# EAGLE schematic industrial-microcontroller (EAGLE 7.7.0)
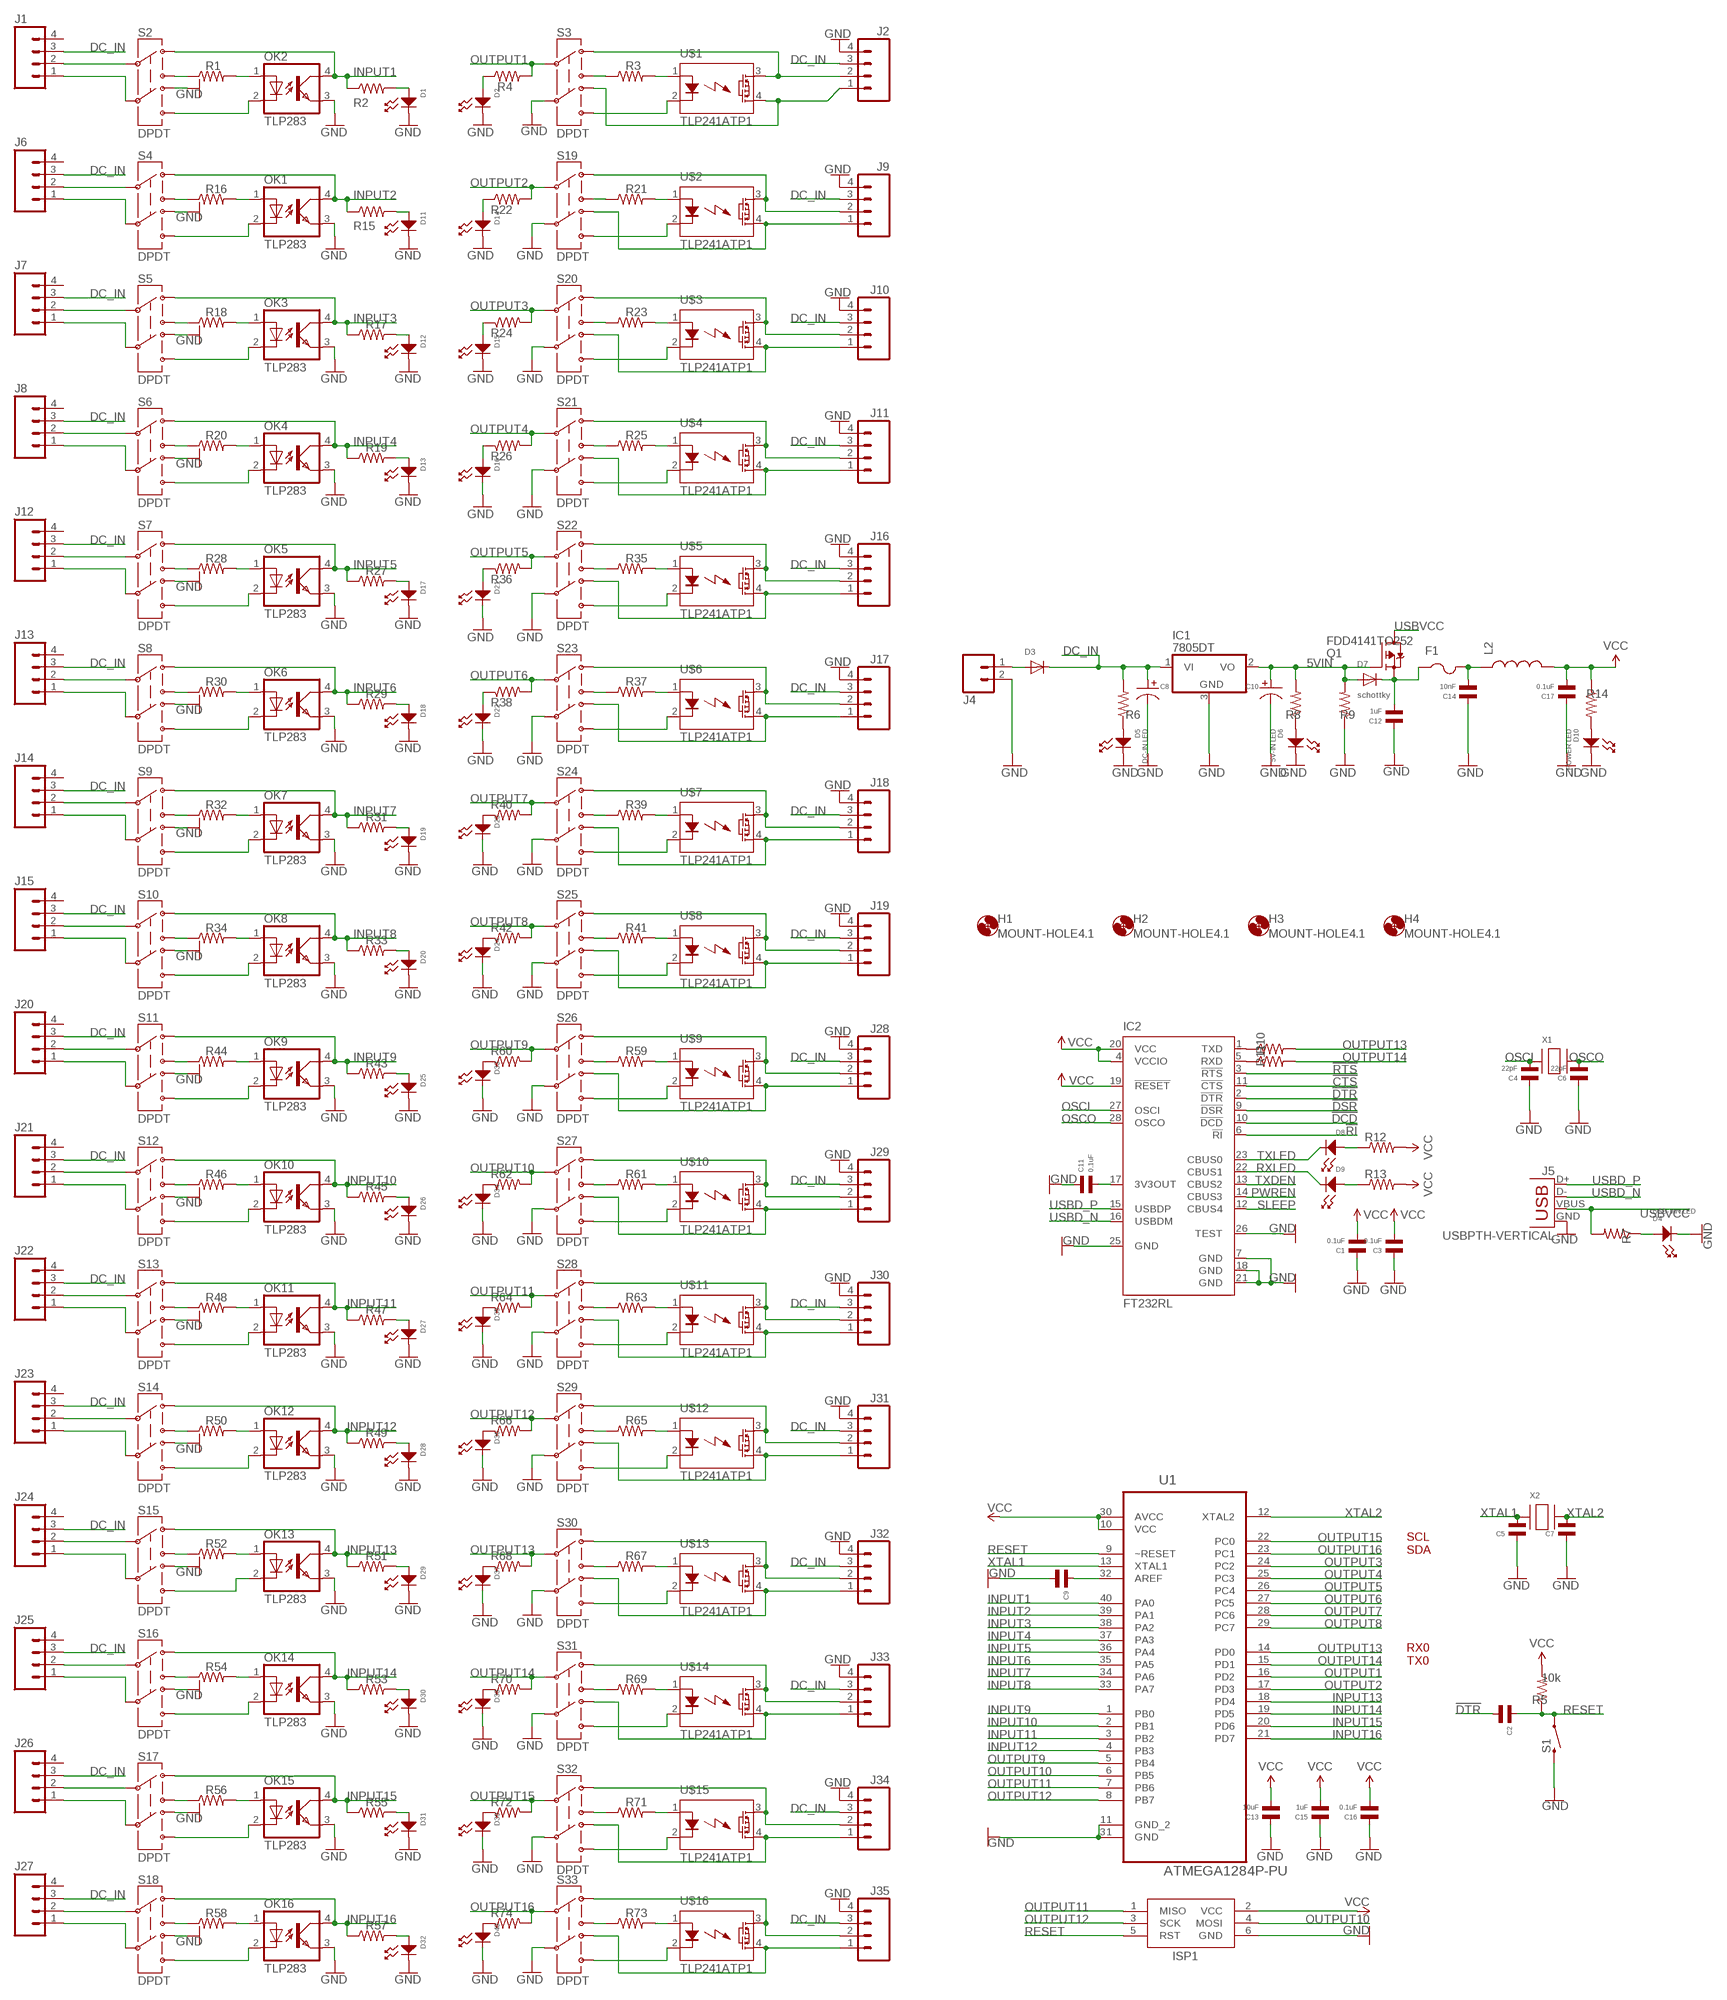
[diagram p0: schematic, sheet 1]

## Parts
C1  0.1uF  CAPACITOR_NP_0805  [C0805]
C2  CAPACITOR_NP_0805  [C0805]
C3  0.1uF  CAPACITOR_NP_0805  [C0805]
C4  22pF  CAPACITOR_NP_0805  [C0805]
C5  CAPACITOR_NP_0805  [C0805]
C6  22pF  CAPACITOR_NP_0805  [C0805]
C7  CAPACITOR_NP_0805  [C0805]
C8  CAPACITOR_P_10MM  [CP10MM]
C9  CAPACITOR_NP_0805  [C0805]
C10  CAPACITOR_P_10MM  [CP10MM]
C11  0.1uF  CAPACITOR_NP_0805  [C0805]
C12  1uF  CAPACITOR_NP_0805  [C0805]
C13  10uF  CAPACITOR_NP_0805  [C0805]
C14  10nF  CAPACITOR_NP_0805  [C0805]
C15  1uF  CAPACITOR_NP_0805  [C0805]
C16  0.1uF  CAPACITOR_NP_0805  [C0805]
C17  0.1uF  CAPACITOR_NP_0805  [C0805]
D1  LED_SINGLE-0805  [LED0805]
D2  LED_SINGLE-0805  [LED0805]
D3  DIODESMA  [SMADIODE]
D4  USB-VIN LED  LED_SINGLE-0805  [LED0805]
D5  DC-IN LED  LED_SINGLE-0805  [LED0805]
D6  5V-IN LED  LED_SINGLE-0805  [LED0805]
D7  schottky  DIODESMA  [SMADIODE]
D8  LED_SINGLE-0805  [LED0805]
D9  LED_SINGLE-0805  [LED0805]
D10  POWER LED  LED_SINGLE-0805  [LED0805]
D11  LED_SINGLE-0805  [LED0805]
D12  LED_SINGLE-0805  [LED0805]
D13  LED_SINGLE-0805  [LED0805]
D14  LED_SINGLE-0805  [LED0805]
D15  LED_SINGLE-0805  [LED0805]
D16  LED_SINGLE-0805  [LED0805]
D17  LED_SINGLE-0805  [LED0805]
D18  LED_SINGLE-0805  [LED0805]
D19  LED_SINGLE-0805  [LED0805]
D20  LED_SINGLE-0805  [LED0805]
D21  LED_SINGLE-0805  [LED0805]
D22  LED_SINGLE-0805  [LED0805]
D23  LED_SINGLE-0805  [LED0805]
D24  LED_SINGLE-0805  [LED0805]
D25  LED_SINGLE-0805  [LED0805]
D26  LED_SINGLE-0805  [LED0805]
D27  LED_SINGLE-0805  [LED0805]
D28  LED_SINGLE-0805  [LED0805]
D29  LED_SINGLE-0805  [LED0805]
D30  LED_SINGLE-0805  [LED0805]
D31  LED_SINGLE-0805  [LED0805]
D32  LED_SINGLE-0805  [LED0805]
D33  LED_SINGLE-0805  [LED0805]
D34  LED_SINGLE-0805  [LED0805]
D35  LED_SINGLE-0805  [LED0805]
D36  LED_SINGLE-0805  [LED0805]
D37  LED_SINGLE-0805  [LED0805]
D38  LED_SINGLE-0805  [LED0805]
D39  LED_SINGLE-0805  [LED0805]
D40  LED_SINGLE-0805  [LED0805]
F1  PTCFUSE-1812  [1812]
H1  MOUNT-HOLE4.1  [4,1]
H2  MOUNT-HOLE4.1  [4,1]
H3  MOUNT-HOLE4.1  [4,1]
H4  MOUNT-HOLE4.1  [4,1]
IC1  7805DT  [TO252]
IC2  FT232RL  [SSOP28]
ISP1  AVRISP-BOX  [AVRISP-BOX]
J1  M04POLAR  [MOLEX-1X4]
J2  M04POLAR  [MOLEX-1X4]
J4  M02POLAR  [MOLEX-1X2]
J5  USBPTH-VERTICAL  [USB-B-PTH-VERTICAL]
J6  M04POLAR  [MOLEX-1X4]
J7  M04POLAR  [MOLEX-1X4]
J8  M04POLAR  [MOLEX-1X4]
J9  M04POLAR  [MOLEX-1X4]
J10  M04POLAR  [MOLEX-1X4]
J11  M04POLAR  [MOLEX-1X4]
J12  M04POLAR  [MOLEX-1X4]
J13  M04POLAR  [MOLEX-1X4]
J14  M04POLAR  [MOLEX-1X4]
J15  M04POLAR  [MOLEX-1X4]
J16  M04POLAR  [MOLEX-1X4]
J17  M04POLAR  [MOLEX-1X4]
J18  M04POLAR  [MOLEX-1X4]
J19  M04POLAR  [MOLEX-1X4]
J20  M04POLAR  [MOLEX-1X4]
J21  M04POLAR  [MOLEX-1X4]
J22  M04POLAR  [MOLEX-1X4]
J23  M04POLAR  [MOLEX-1X4]
J24  M04POLAR  [MOLEX-1X4]
J25  M04POLAR  [MOLEX-1X4]
J26  M04POLAR  [MOLEX-1X4]
J27  M04POLAR  [MOLEX-1X4]
J28  M04POLAR  [MOLEX-1X4]
J29  M04POLAR  [MOLEX-1X4]
J30  M04POLAR  [MOLEX-1X4]
J31  M04POLAR  [MOLEX-1X4]
J32  M04POLAR  [MOLEX-1X4]
J33  M04POLAR  [MOLEX-1X4]
J34  M04POLAR  [MOLEX-1X4]
J35  M04POLAR  [MOLEX-1X4]
L2  INDUCTORCR75_V2  [CR75_V2]
OK1  TLP283  [MINI-FLAT-4]
OK2  TLP283  [MINI-FLAT-4]
OK3  TLP283  [MINI-FLAT-4]
OK4  TLP283  [MINI-FLAT-4]
OK5  TLP283  [MINI-FLAT-4]
OK6  TLP283  [MINI-FLAT-4]
OK7  TLP283  [MINI-FLAT-4]
OK8  TLP283  [MINI-FLAT-4]
OK9  TLP283  [MINI-FLAT-4]
OK10  TLP283  [MINI-FLAT-4]
OK11  TLP283  [MINI-FLAT-4]
OK12  TLP283  [MINI-FLAT-4]
OK13  TLP283  [MINI-FLAT-4]
OK14  TLP283  [MINI-FLAT-4]
OK15  TLP283  [MINI-FLAT-4]
OK16  TLP283  [MINI-FLAT-4]
Q1  FDD4141TO252  [TO252]
R1  RESISTOR_0805  [R0805]
R2  RESISTOR_0805  [R0805]
R3  RESISTOR_0805  [R0805]
R4  RESISTOR_0805  [R0805]
R5  10k  RESISTOR_0805  [R0805]
R6  RESISTOR_0805  [R0805]
R7  RESISTOR_0805  [R0805]
R8  RESISTOR_0805  [R0805]
R9  RESISTOR_0805  [R0805]
R10  RESISTOR_0805  [R0805]
R11  RESISTOR_0805  [R0805]
R12  RESISTOR_0805  [R0805]
R13  RESISTOR_0805  [R0805]
R14  RESISTOR_0805  [R0805]
R15  RESISTOR_0805  [R0805]
R16  RESISTOR_0805  [R0805]
R17  RESISTOR_0805  [R0805]
R18  RESISTOR_0805  [R0805]
R19  RESISTOR_0805  [R0805]
R20  RESISTOR_0805  [R0805]
R21  RESISTOR_0805  [R0805]
R22  RESISTOR_0805  [R0805]
R23  RESISTOR_0805  [R0805]
R24  RESISTOR_0805  [R0805]
R25  RESISTOR_0805  [R0805]
R26  RESISTOR_0805  [R0805]
R27  RESISTOR_0805  [R0805]
R28  RESISTOR_0805  [R0805]
R29  RESISTOR_0805  [R0805]
R30  RESISTOR_0805  [R0805]
R31  RESISTOR_0805  [R0805]
R32  RESISTOR_0805  [R0805]
R33  RESISTOR_0805  [R0805]
R34  RESISTOR_0805  [R0805]
R35  RESISTOR_0805  [R0805]
R36  RESISTOR_0805  [R0805]
R37  RESISTOR_0805  [R0805]
R38  RESISTOR_0805  [R0805]
R39  RESISTOR_0805  [R0805]
R40  RESISTOR_0805  [R0805]
R41  RESISTOR_0805  [R0805]
R42  RESISTOR_0805  [R0805]
R43  RESISTOR_0805  [R0805]
R44  RESISTOR_0805  [R0805]
R45  RESISTOR_0805  [R0805]
R46  RESISTOR_0805  [R0805]
R47  RESISTOR_0805  [R0805]
R48  RESISTOR_0805  [R0805]
R49  RESISTOR_0805  [R0805]
R50  RESISTOR_0805  [R0805]
R51  RESISTOR_0805  [R0805]
R52  RESISTOR_0805  [R0805]
R53  RESISTOR_0805  [R0805]
R54  RESISTOR_0805  [R0805]
R55  RESISTOR_0805  [R0805]
R56  RESISTOR_0805  [R0805]
R57  RESISTOR_0805  [R0805]
R58  RESISTOR_0805  [R0805]
R59  RESISTOR_0805  [R0805]
R60  RESISTOR_0805  [R0805]
R61  RESISTOR_0805  [R0805]
R62  RESISTOR_0805  [R0805]
R63  RESISTOR_0805  [R0805]
R64  RESISTOR_0805  [R0805]
R65  RESISTOR_0805  [R0805]
R66  RESISTOR_0805  [R0805]
R67  RESISTOR_0805  [R0805]
R68  RESISTOR_0805  [R0805]
R69  RESISTOR_0805  [R0805]
R70  RESISTOR_0805  [R0805]
R71  RESISTOR_0805  [R0805]
R72  RESISTOR_0805  [R0805]
R73  RESISTOR_0805  [R0805]
R74  RESISTOR_0805  [R0805]
S1  SWITCH-MOMENTARY-212MM  [TACTILE-PTH-12MM]
S2  DPDT  SWITCH-DPDTJS  [JS202011JCON]
S3  DPDT  SWITCH-DPDTJS  [JS202011JCON]
S4  DPDT  SWITCH-DPDTJS  [JS202011JCON]
S5  DPDT  SWITCH-DPDTJS  [JS202011JCON]
S6  DPDT  SWITCH-DPDTJS  [JS202011JCON]
S7  DPDT  SWITCH-DPDTJS  [JS202011JCON]
S8  DPDT  SWITCH-DPDTJS  [JS202011JCON]
S9  DPDT  SWITCH-DPDTJS  [JS202011JCON]
S10  DPDT  SWITCH-DPDTJS  [JS202011JCON]
S11  DPDT  SWITCH-DPDTJS  [JS202011JCON]
S12  DPDT  SWITCH-DPDTJS  [JS202011JCON]
S13  DPDT  SWITCH-DPDTJS  [JS202011JCON]
S14  DPDT  SWITCH-DPDTJS  [JS202011JCON]
S15  DPDT  SWITCH-DPDTJS  [JS202011JCON]
S16  DPDT  SWITCH-DPDTJS  [JS202011JCON]
S17  DPDT  SWITCH-DPDTJS  [JS202011JCON]
S18  DPDT  SWITCH-DPDTJS  [JS202011JCON]
S19  DPDT  SWITCH-DPDTJS  [JS202011JCON]
S20  DPDT  SWITCH-DPDTJS  [JS202011JCON]
S21  DPDT  SWITCH-DPDTJS  [JS202011JCON]
S22  DPDT  SWITCH-DPDTJS  [JS202011JCON]
S23  DPDT  SWITCH-DPDTJS  [JS202011JCON]
S24  DPDT  SWITCH-DPDTJS  [JS202011JCON]
S25  DPDT  SWITCH-DPDTJS  [JS202011JCON]
S26  DPDT  SWITCH-DPDTJS  [JS202011JCON]
S27  DPDT  SWITCH-DPDTJS  [JS202011JCON]
S28  DPDT  SWITCH-DPDTJS  [JS202011JCON]
S29  DPDT  SWITCH-DPDTJS  [JS202011JCON]
S30  DPDT  SWITCH-DPDTJS  [JS202011JCON]
S31  DPDT  SWITCH-DPDTJS  [JS202011JCON]
S32  DPDT  SWITCH-DPDTJS  [JS202011JCON]
S33  DPDT  SWITCH-DPDTJS  [JS202011JCON]
U1  ATMEGA1284P-PU  [DIP254P1524X483-40]
U$1  TLP241ATP1  [TLP241A-TP1]
U$2  TLP241ATP1  [TLP241A-TP1]
U$3  TLP241ATP1  [TLP241A-TP1]
U$4  TLP241ATP1  [TLP241A-TP1]
U$5  TLP241ATP1  [TLP241A-TP1]
U$6  TLP241ATP1  [TLP241A-TP1]
U$7  TLP241ATP1  [TLP241A-TP1]
U$8  TLP241ATP1  [TLP241A-TP1]
U$9  TLP241ATP1  [TLP241A-TP1]
U$10  TLP241ATP1  [TLP241A-TP1]
U$11  TLP241ATP1  [TLP241A-TP1]
U$12  TLP241ATP1  [TLP241A-TP1]
U$13  TLP241ATP1  [TLP241A-TP1]
U$14  TLP241ATP1  [TLP241A-TP1]
U$15  TLP241ATP1  [TLP241A-TP1]
U$16  TLP241ATP1  [TLP241A-TP1]
X1  XTAL-3.2X1.5  [XTAL3215]
X2  XTAL-3.2X1.5  [XTAL3215]

## Nets
5VIN: C10.P$1 D7.A IC1.2(VO) Q1.1(G) R8.P$2 R9.P$2
!CTS: IC2.11(!CTS)
!DCD: IC2.10(!DCD)
!DSR: IC2.9(!DSR)
!DTR: C2.P$2 IC2.2(!DTR)
!RI: IC2.6(!RI)
!RTS: IC2.3(!RTS)
DC_IN: C8.P$1 D3.C IC1.1(VI) J1.3 J2.3 J6.3 J7.3 J8.3 J9.3 J10.3 J11.3 J12.3 J13.3 J14.3 J15.3 J16.3 J17.3 J18.3 J19.3 J20.3 J21.3 J22.3 J23.3 J24.3 J25.3 J26.3 J27.3 J28.3 J29.3 J30.3 J31.3 J32.3 J33.3 J34.3 J35.3 R6.P$2
GND: C1.P$1 C3.P$1 C4.P$1 C5.P$1 C6.P$1 C7.P$1 C8.P$2 C9.P$2 C10.P$2 C11.P$1 C12.P$1 C13.P$1 C14.P$1 C15.P$1 C16.P$1 C17.P$1 D1.CATHODE D2.CATHODE D4.CATHODE D5.CATHODE D6.CATHODE D10.CATHODE D11.CATHODE D12.CATHODE D13.CATHODE D14.CATHODE D15.CATHODE D16.CATHODE D17.CATHODE D18.CATHODE D19.CATHODE D20.CATHODE D21.CATHODE D22.CATHODE D23.CATHODE D24.CATHODE D25.CATHODE D26.CATHODE D27.CATHODE D28.CATHODE D29.CATHODE D30.CATHODE D31.CATHODE D32.CATHODE D33.CATHODE D34.CATHODE D35.CATHODE D36.CATHODE D37.CATHODE D38.CATHODE D39.CATHODE D40.CATHODE IC1.3(GND) IC2.7(GND) IC2.18(GND) IC2.21(GND) IC2.25(GND) IC2.26(TEST) ISP1.6(GND) J2.4 J4.2 J5.GND J9.4 J10.4 J11.4 J16.4 J17.4 J18.4 J19.4 J28.4 J29.4 J30.4 J31.4 J32.4 J33.4 J34.4 J35.4 OK1.3(EMIT) OK2.3(EMIT) OK3.3(EMIT) OK4.3(EMIT) OK5.3(EMIT) OK6.3(EMIT) OK7.3(EMIT) OK8.3(EMIT) OK9.3(EMIT) OK10.3(EMIT) OK11.3(EMIT) OK12.3(EMIT) OK13.3(EMIT) OK14.3(EMIT) OK15.3(EMIT) OK16.3(EMIT) R9.P$1 S1.3 S2.4 S3.5 S4.4 S5.4 S6.4 S7.4 S8.4 S9.4 S10.4 S11.4 S12.4 S13.4 S14.4 S15.4 S16.4 S17.4 S18.4 S19.5 S20.5 S21.5 S22.5 S23.5 S24.5 S25.5 S26.5 S27.5 S28.5 S29.5 S30.5 S31.5 S32.5 S33.5 U1.11(GND_2) U1.31(GND)
INPUT1: OK2.4(COL) R2.P$1 S2.1 U1.40(PA0)
INPUT2: OK1.4(COL) R15.P$1 S4.1 U1.39(PA1)
INPUT3: OK3.4(COL) R17.P$1 S5.1 U1.38(PA2)
INPUT4: OK4.4(COL) R19.P$1 S6.1 U1.37(PA3)
INPUT5: OK5.4(COL) R27.P$1 S7.1 U1.36(PA4)
INPUT6: OK6.4(COL) R29.P$1 S8.1 U1.35(PA5)
INPUT7: OK7.4(COL) R31.P$1 S9.1 U1.34(PA6)
INPUT8: OK8.4(COL) R33.P$1 S10.1 U1.33(PA7)
INPUT9: OK9.4(COL) R43.P$1 S11.1 U1.1(PB0)
INPUT10: OK10.4(COL) R45.P$1 S12.1 U1.2(PB1)
INPUT11: OK11.4(COL) R47.P$1 S13.1 U1.3(PB2)
INPUT12: OK12.4(COL) R49.P$1 S14.1 U1.4(PB3)
INPUT13: OK13.4(COL) R51.P$1 S15.1 U1.18(PD4)
INPUT14: OK14.4(COL) R53.P$1 S16.1 U1.19(PD5)
INPUT15: OK15.4(COL) R55.P$1 S17.1 U1.20(PD6)
INPUT16: OK16.4(COL) R57.P$1 S18.1 U1.21(PD7)
N$1: D5.ANODE R6.P$1
N$2: D1.ANODE R2.P$2
N$3: D6.ANODE R8.P$1
N$4: C14.P$2 F1.2 L2.P$1
N$5: D10.ANODE R14.P$2
N$6: D3.A J4.1
N$7: D4.ANODE R7.P$1
N$8: D11.ANODE R15.P$2
N$9: R18.P$1 S5.3
N$10: R3.P$2 U$1.1(A)
N$11: R20.P$1 S6.3
N$12: OK1.1(A) R16.P$2
N$13: D12.ANODE R17.P$2
N$14: R28.P$1 S7.3
N$15: R30.P$1 S8.3
N$16: OK3.1(A) R18.P$2
N$17: D2.ANODE R4.P$1
N$18: D13.ANODE R19.P$2
N$19: R32.P$1 S9.3
N$20: OK2.2(C) S2.6
N$21: R34.P$1 S10.3
N$22: OK4.1(A) R20.P$2
N$23: R1.P$1 S2.3
N$24: D14.ANODE R22.P$1
N$25: J9.2 S19.1 U$2.3(DS1)
N$26: OK2.1(A) R1.P$2
N$27: J9.1 S19.4 U$2.4(DS2)
N$28: R21.P$2 U$2.1(A)
N$29: D15.ANODE R24.P$1
N$30: J10.2 S20.1 U$3.3(DS1)
N$31: J10.1 S20.4 U$3.4(DS2)
N$32: R23.P$2 U$3.1(A)
N$33: D16.ANODE R26.P$1
N$34: J11.2 S21.1 U$4.3(DS1)
N$35: J2.2 S3.1 U$1.3(DS1)
N$36: J11.1 S21.4 U$4.4(DS2)
N$37: R25.P$2 U$4.1(A)
N$38: J2.1 S3.4 U$1.4(DS2)
N$39: D17.ANODE R27.P$2
N$40: R44.P$1 S11.3
N$41: R46.P$1 S12.3
N$42: OK5.1(A) R28.P$2
N$43: D18.ANODE R29.P$2
N$44: R48.P$1 S13.3
N$45: R50.P$1 S14.3
N$46: OK6.1(A) R30.P$2
N$47: D19.ANODE R31.P$2
N$48: R52.P$1 S15.3
N$49: R54.P$1 S16.3
N$50: C11.P$2 IC2.17(3V3OUT)
N$51: OK7.1(A) R32.P$2
N$52: D20.ANODE R33.P$2
N$53: D8.ANODE R12.P$1
N$54: R56.P$1 S17.3
N$55: D9.ANODE R13.P$1
N$56: IC2.1(TXD) R10.P$1
N$57: IC2.5(RXD) R11.P$1
N$58: R58.P$1 S18.3
N$59: OK8.1(A) R34.P$2
N$60: C9.P$1 U1.32(AREF)
N$61: D21.ANODE R36.P$1
N$62: J16.2 S22.1 U$5.3(DS1)
N$63: J16.1 S22.4 U$5.4(DS2)
N$64: C12.P$2 D7.C F1.1 Q1.2(S)
N$65: R35.P$2 U$5.1(A)
N$66: D22.ANODE R38.P$1
N$67: J17.2 S23.1 U$6.3(DS1)
N$68: J17.1 S23.4 U$6.4(DS2)
N$69: R37.P$2 U$6.1(A)
N$70: D23.ANODE R40.P$1
N$71: J18.2 S24.1 U$7.3(DS1)
N$72: J18.1 S24.4 U$7.4(DS2)
N$73: R39.P$2 U$7.1(A)
N$74: D24.ANODE R42.P$1
N$75: J19.2 S25.1 U$8.3(DS1)
N$76: J19.1 S25.4 U$8.4(DS2)
N$77: R41.P$2 U$8.1(A)
N$78: D25.ANODE R43.P$2
N$79: R16.P$1 S4.3
N$80: J6.2 S4.2
N$81: OK9.1(A) R44.P$2
N$82: D26.ANODE R45.P$2
N$83: J6.1 S4.5
N$84: J7.1 S5.5
N$85: OK10.1(A) R46.P$2
N$86: D27.ANODE R47.P$2
N$87: J7.2 S5.2
N$88: OK1.2(C) S4.6
N$89: OK11.1(A) R48.P$2
N$90: D28.ANODE R49.P$2
N$91: OK3.2(C) S5.6
N$92: J8.2 S6.2
N$93: OK12.1(A) R50.P$2
N$94: D29.ANODE R51.P$2
N$95: J8.1 S6.5
N$96: OK4.2(C) S6.6
N$97: OK13.1(A) R52.P$2
N$98: D30.ANODE R53.P$2
N$99: J12.2 S7.2
N$100: J12.1 S7.5
N$101: OK14.1(A) R54.P$2
N$102: D31.ANODE R55.P$2
N$103: OK5.2(C) S7.6
N$104: OK6.2(C) S8.6
N$105: OK15.1(A) R56.P$2
N$106: D32.ANODE R57.P$2
N$107: J13.2 S8.2
N$108: J13.1 S8.5
N$109: OK16.1(A) R58.P$2
N$110: D33.ANODE R60.P$1
N$111: J28.2 S26.1 U$9.3(DS1)
N$112: J28.1 S26.4 U$9.4(DS2)
N$113: R59.P$2 U$9.1(A)
N$114: D34.ANODE R62.P$1
N$115: J29.2 S27.1 U$10.3(DS1)
N$116: J29.1 S27.4 U$10.4(DS2)
N$117: R61.P$2 U$10.1(A)
N$118: D35.ANODE R64.P$1
N$119: J30.2 S28.1 U$11.3(DS1)
N$120: J30.1 S28.4 U$11.4(DS2)
N$121: R63.P$2 U$11.1(A)
N$122: D36.ANODE R66.P$1
N$123: J31.2 S29.1 U$12.3(DS1)
N$124: J31.1 S29.4 U$12.4(DS2)
N$125: R65.P$2 U$12.1(A)
N$126: D37.ANODE R68.P$1
N$127: J32.2 S30.1 U$13.3(DS1)
N$128: J32.1 S30.4 U$13.4(DS2)
N$129: R67.P$2 U$13.1(A)
N$130: D38.ANODE R70.P$1
N$131: J33.2 S31.1 U$14.3(DS1)
N$132: J33.1 S31.4 U$14.4(DS2)
N$133: R69.P$2 U$14.1(A)
N$134: D39.ANODE R72.P$1
N$135: J34.2 S32.1 U$15.3(DS1)
N$136: J34.1 S32.4 U$15.4(DS2)
N$137: R71.P$2 U$15.1(A)
N$138: D40.ANODE R74.P$1
N$139: J35.2 S33.1 U$16.3(DS1)
N$140: J35.1 S33.4 U$16.4(DS2)
N$141: R73.P$2 U$16.1(A)
N$142: J1.2 S2.2
N$143: J1.1 S2.5
N$144: R3.P$1 S3.3
N$145: S3.6 U$1.2(K)
N$146: J14.2 S9.2
N$147: J14.1 S9.5
N$148: OK7.2(C) S9.6
N$149: J15.2 S10.2
N$150: J15.1 S10.5
N$151: OK8.2(C) S10.6
N$152: J20.2 S11.2
N$153: J20.1 S11.5
N$154: OK9.2(C) S11.6
N$155: OK10.2(C) S12.6
N$156: J21.2 S12.2
N$157: J21.1 S12.5
N$158: J22.2 S13.2
N$159: J22.1 S13.5
N$160: OK11.2(C) S13.6
N$161: J23.2 S14.2
N$162: S14.5
N$163: OK12.2(C) S14.6
N$164: OK13.2(C) S15.6
N$165: J24.2 S15.2
N$166: J24.1 S15.5
N$167: J25.2 S16.2
N$168: J25.1 S16.5
N$169: OK14.2(C) S16.6
N$170: J26.2 S17.2
N$171: J26.1 S17.5
N$172: J27.2 S18.2
N$173: J27.1 S18.5
N$174: OK15.2(C) S17.6
N$175: OK16.2(C) S18.6
N$176: R21.P$1 S19.3
N$177: R23.P$1 S20.3
N$178: S19.6 U$2.2(K)
N$179: S20.6 U$3.2(K)
N$181: R25.P$1 S21.3
N$182: S21.6 U$4.2(K)
N$184: R35.P$1 S22.3
N$185: S22.6 U$5.2(K)
N$187: R37.P$1 S23.3
N$189: S23.6 U$6.2(K)
N$190: R39.P$1 S24.3
N$192: S24.6 U$7.2(K)
N$193: R41.P$1 S25.3
N$195: S25.6 U$8.2(K)
N$196: R59.P$1 S26.3
N$198: S26.6 U$9.2(K)
N$199: R61.P$1 S27.3
N$201: S27.6 U$10.2(K)
N$202: R63.P$1 S28.3
N$204: S28.6 U$11.2(K)
N$205: R65.P$1 S29.3
N$207: S29.6 U$12.2(K)
N$208: R67.P$1 S30.3
N$210: S30.6 U$13.2(K)
N$211: R69.P$1 S31.3
N$213: S31.6 U$14.2(K)
N$214: R71.P$1 S32.3
N$216: S32.6 U$15.2(K)
N$217: R73.P$1 S33.3
N$219: S33.6 U$16.2(K)
OSCI: C4.P$2 IC2.27(OSCI) X1.P$1
OSCO: C6.P$2 IC2.28(OSCO) X1.P$2
OUTPUT1: R4.P$2 S3.2 U1.16(PD2)
OUTPUT2: R22.P$2 S19.2 U1.17(PD3)
OUTPUT3: R24.P$2 S20.2 U1.24(PC2)
OUTPUT4: R26.P$2 S21.2 U1.25(PC3)
OUTPUT5: R36.P$2 S22.2 U1.26(PC4)
OUTPUT6: R38.P$2 S23.2 U1.27(PC5)
OUTPUT7: R40.P$2 S24.2 U1.28(PC6)
OUTPUT8: R42.P$2 S25.2 U1.29(PC7)
OUTPUT9: R60.P$2 S26.2 U1.5(PB4)
OUTPUT10: ISP1.4(MOSI) R62.P$2 S27.2 U1.6(PB5)
OUTPUT11: ISP1.1(MISO) R64.P$2 S28.2 U1.7(PB6)
OUTPUT12: ISP1.3(SCK) R66.P$2 S29.2 U1.8(PB7)
OUTPUT13: R10.P$2 R68.P$2 S30.2 U1.14(PD0)
OUTPUT14: R11.P$2 R70.P$2 S31.2 U1.15(PD1)
OUTPUT15: R72.P$2 S32.2 U1.22(PC0)
OUTPUT16: R74.P$2 S33.2 U1.23(PC1)
PWREN: IC2.14(CBUS3)
RESET: C2.P$1 ISP1.5(RST) R5.P$1 S1.1 U1.9(~RESET)
RXLED: D9.CATHODE IC2.22(CBUS1)
SLEEP: IC2.12(CBUS4)
TXDEN: IC2.13(CBUS2)
TXLED: D8.CATHODE IC2.23(CBUS0)
USBD_N [usb]: IC2.16(USBDM) J5.D-
USBD_P [usb]: IC2.15(USBDP) J5.D+
USBVCC: J5.VBUS Q1.3(D) R7.P$2
VCC: C1.P$2 C3.P$2 C13.P$2 C15.P$2 C16.P$2 C17.P$2 IC2.4(VCCIO) IC2.19(!RESET) IC2.20(VCC) ISP1.2(VCC) L2.P$2 R5.P$2 R12.P$2 R13.P$2 R14.P$1 U1.10(VCC) U1.30(AVCC)
XTAL1: C5.P$2 U1.13(XTAL1) X2.P$1
XTAL2: C7.P$2 U1.12(XTAL2) X2.P$2
Unconnected: J1.4 J6.4 J7.4 J8.4 J12.4 J13.4 J14.4 J15.4 J20.4 J21.4 J22.4 J23.1 J23.4 J24.4 J25.4 J26.4 J27.4

## Notes on the sheet
- SCL
  SDA
- RX0
  TX0

## Library data of the parts
C1-C7 C9 C11-C17 = MF_Passives:CAPACITOR_NP: Library: MF_Passives Description: Device for Non-Polarized Capacitors. Manufacture part number (MPN) can be added via Attributes. Check https://factory.macrofab.com/parts for the house parts list.; POPULATE: 1
C8 C10 = MF_Passives:CAPACITOR_P: Library: MF_Passives Description: Device for Polarized Capacitors. Manufacture part number (MPN), Voltage Rating, and Tolerance can be added via Attributes. Check https://factory.macrofab.com/parts for the house parts list.; POPULATE: 1
D1 D2 D4-D6 D8-D40 = MF_LEDs:LED_SINGLE: Library: MF_LEDs Description: Device for Single LED Packages. Manufacture part number (MFG#) can be added via Attributes.; HOUSEPART: NO; POPULATE: 1
D3 D7 = adafruit:DIODE: Diode SMADIODE - SMA Surface Mount Package 20V 1A Schottky Diode Digikey: 641-1014-6-ND DO-1N4148 - Through Hole Small Current Diode SOD-123 20V 1 A (.5mV Vf) Schottky Diode - Digikey: MBRX120TPMSCT-ND SOD-323 10V 570mA (.38mV Vf, 3ns) Schottky Diode - Digikey: ZLLS410CT-ND SOD-523 30V 30mA Schottky Diode (RB751S-40TE61) - Digikey: RB751S-40TE61CT-ND SOT23-R/W - SOT23 Package (R = Solder Paste/Reflow Ovens, W = Hand-Soldering) BAT54Film 40V 300mA - Digikey: 497-7162-1-ND
F1 = adafruit:PTCFUSE: PTC fuses, resettable thermistors
H1-H4 = holes:MOUNT-HOLE: MOUNTING HOLE with drill center marker
IC1 = linear:78*: Positive VOLTAGE REGULATOR Source: http://cache.national.com/ds/LM/LM78L05.pdf http://www.fairchildsemi.com/ds/LM/LM7805.pdf
IC2 = ftdichip:FT232R: Source: http://www.ftdichip.com/Documents/DataSheets/DS_FT232R_v104.pdf; MPN: FT232RL; OC_FARNELL: 1146032; OC_NEWARK: 91K9918
ISP1 = adafruit:AVRISP: AVR ISP HEADER Standard 6 pin header for AVR programming
J1 J2 J6-J35 = SparkFun-Connectors:M04: Header 4 Standard 4-pin 0.1" header. Use with straight break away headers (SKU : PRT-00116), right angle break away headers (PRT-00553), swiss pins (PRT-00743), machine pins (PRT-00117), and female headers (PRT-00115). Molex polarized connector foot print use with SKU : PRT-08231 with associated crimp pins and housings. 1MM SMD Version SKU: PRT-10208
J4 = SparkFun-Connectors:M02: Standard 2-pin 0.1" header. Use with - straight break away headers ( PRT-00116) - right angle break away headers (PRT-00553) - swiss pins (PRT-00743) - machine pins (PRT-00117) - female headers (PRT-00115) Molex polarized connector foot print use with: PRT-08233 with associated crimp pins and housings. 2.54_SCREWTERM for use with PRT-10571. 3.5mm Screw Terminal footprints for PRT-08084 5mm Screw Terminal footprints for use with PRT-08432
J5 = SparkFun-Connectors:USB: USB Connectors USB-B-PTH is fully proven SKU : PRT-00139/CONN-08278 USB-miniB is fully proven SKU : PRT-00587 USB-A-PCB is untested. USB-A-H is throughly reviewed, but untested. Spark Fun Electronics SKU : PRT-00437 USB-B-SMT is throughly reviewed, but untested. Needs silkscreen touching up. USB-A-S has not been used/tested USB-MB-H has not been used/tested USB-MICROB has been used. CONN-09505
L2 = SparkFun-Passives:INDUCTOR: Inductors Basic Inductor/Choke - 0603 and 1206. Footprints are not proven and vary greatly between part numbers. INDUCTOR POWER 3.3UH 4.0A SMD 0.197" L x 0.197" W x 0.177" H (5.00mm x 5.00mm x 4.50mm)
OK1-OK16 = optocoupler:TLP283: TOSHIBA PHOTOCOUPLER GaAs IRED & PHOTO-TRANSISTOR Source: http://www.semicon.toshiba.co.jp/td/en/Opto/Photocoupler/en_20050928_TLP283_datasheet.pdf; OC_FARNELL: unknown; OC_NEWARK: unknown
Q1 = transistor-fet:FDD4141: P-Channel PowerTrench® MOSFET Source: FDD4141.pdf
R1-R74 = MF_Passives:RESISTOR: Library: MF_Passives Description: Device for Resistors. Manufacture part number (MPN), Voltage, Tolerance, and Wattage Rating can be added via Attributes. Check https://factory.macrofab.com/parts for the house parts list.; POPULATE: 1
S1 = SparkFun-Electromechanical:SWITCH-MOMENTARY-2: Various NO switches- pushbuttons, reed, etc; PROD_ID: SWCH-09185
S2-S33 = SparkFun-Electromechanical:SWITCH-DPDT: DPDT Version of the COM-00597
U1 = element14Atmel:ATMEGA1284P-PU: 8-bit Microcontroller with In-System Programmable Flash; MPN: ATMEGA1284P-PU; OC_FARNELL: 1715481; OC_NEWARK: 15R0264; PACKAGE: PDIP-40; SUPPLIER: Atmel
U$1-U$16 = sonik:TLP241A
X1 X2 = adafruit:XTAL: Low cost SMT crystals, no capacitors included http://www.ladyada.net/library/eagle